# EAGLE design VGA_Tetris (EAGLE 5.11)
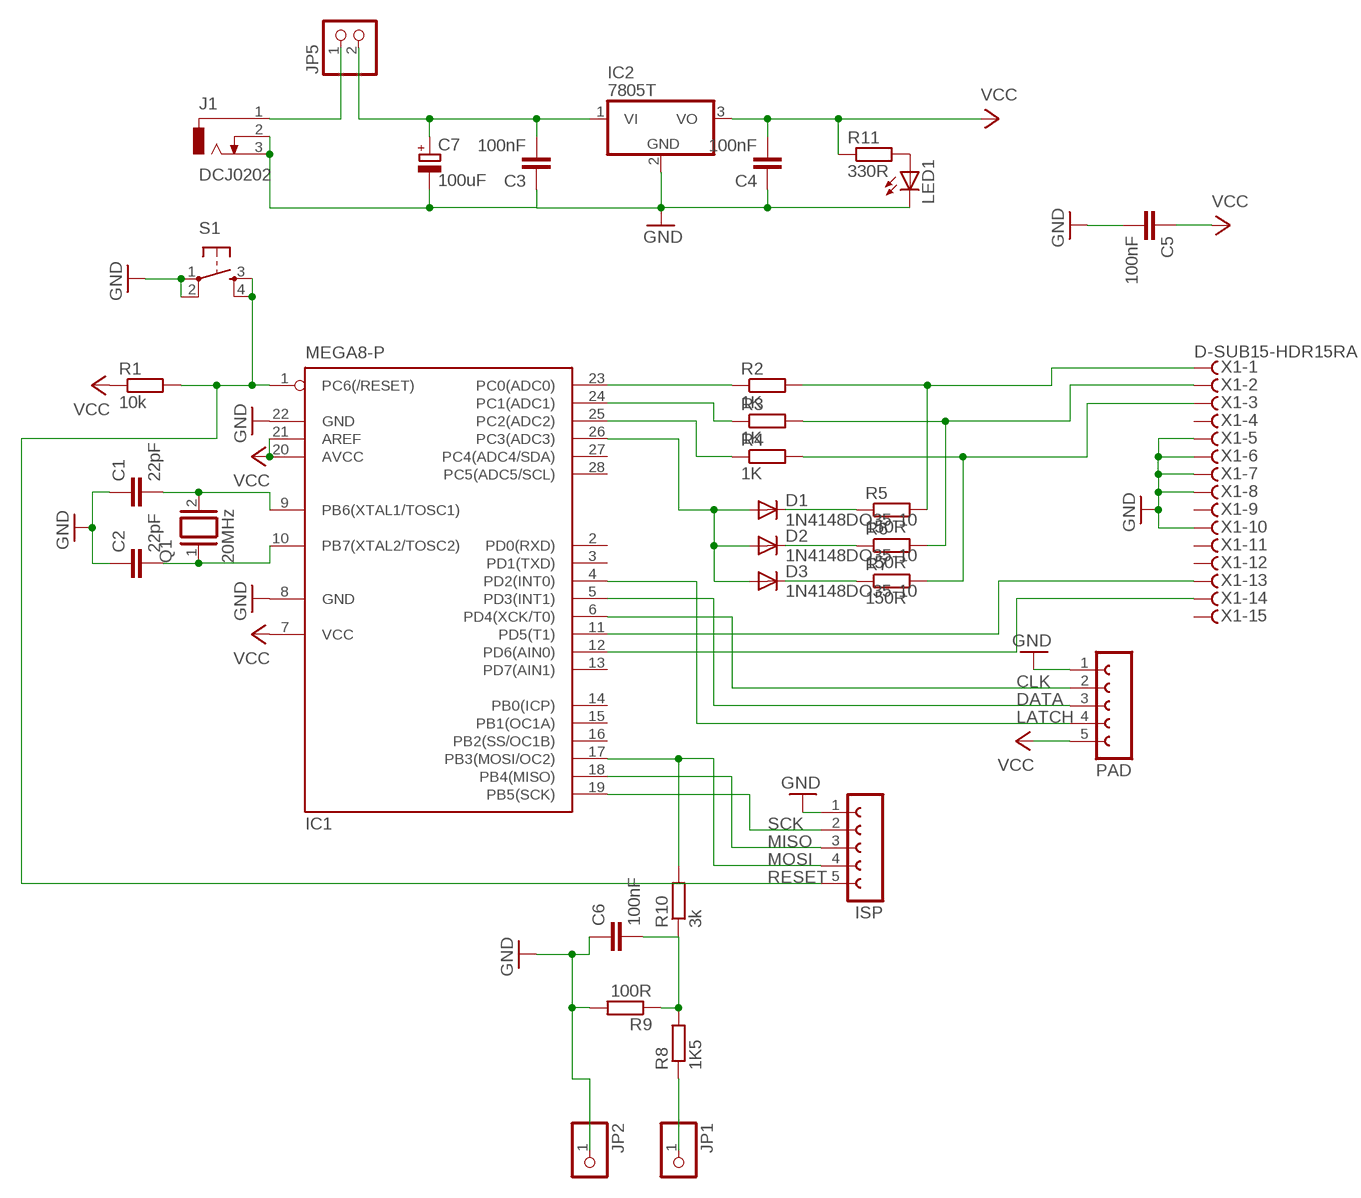
[diagram p0: schematic, sheet 1]

## Parts
C1  22pF  C-EU025-024X044  [C025-024X044]
C2  22pF  C-EU025-024X044  [C025-024X044]
C3  100nF  C-EU025-024X044  [C025-024X044]
C4  100nF  C-EU025-024X044  [C025-024X044]
C5  100nF  C-EU025-024X044  [C025-024X044]
C6  100nF  C-EU025-024X044  [C025-024X044]
C7  100uF  CPOL-EUE5-10.5  [E5-10,5]
D1  1N4148DO35-10  [DO35-10]
D2  1N4148DO35-10  [DO35-10]
D3  1N4148DO35-10  [DO35-10]
IC1  MEGA8-P  [DIL28-3]
IC2  7805T  [TO220H]
ISP  FE05-1  [FE05-1]
J1  DCJ0202  [DCJ0202]
JP1  PINHD-1X1  [1X01]
JP2  PINHD-1X1  [1X01]
JP5  PINHD-1X2  [1X02]
LED1  LED3MM  [LED3MM]
PAD  FE05-1  [FE05-1]
Q1  20MHz  XTAL/S  [QS]
R1  10k  R-EU_0207/10  [0207/10]
R2  1K  R-EU_0207/10  [0207/10]
R3  1K  R-EU_0207/10  [0207/10]
R4  1K  R-EU_0207/10  [0207/10]
R5  150R  R-EU_0207/10  [0207/10]
R6  150R  R-EU_0207/10  [0207/10]
R7  150R  R-EU_0207/10  [0207/10]
R8  1K5  R-EU_0207/10  [0207/10]
R9  100R  R-EU_0207/10  [0207/10]
R10  3k  R-EU_0207/10  [0207/10]
R11  330R  R-EU_0207/10  [0207/10]
S1  TAC_SWITCHPTH  [TACTILE-PTH]
X1  D-SUB15-HDR15RA  [HDR15RA]

## Nets
CLK: IC1.6(PD4(XCK/T0)) PAD.2
DATA: IC1.5(PD3(INT1)) PAD.3
GND: C1.1 C2.1 C3.1 C4.1 C5.2 C6.1 C7.- IC1.8(GND) IC1.22(GND) IC2.2(GND) ISP.1 J1.2 J1.3 JP2.1 LED1.K(C) PAD.1 R9.2 S1.1 S1.2 X1.5 X1.6 X1.7 X1.8 X1.10
LATCH: IC1.4(PD2(INT0)) PAD.4
MISO: IC1.18(PB4(MISO)) ISP.3
MOSI: IC1.17(PB3(MOSI/OC2)) ISP.4 R10.2
N$1: C1.2 IC1.9(PB6(XTAL1/TOSC1)) Q1.2
N$2: C2.2 IC1.10(PB7(XTAL2/TOSC2)) Q1.1
N$3: C3.2 C7.+ IC2.1(VI) JP5.2
N$5: IC1.23(PC0(ADC0)) R2.1
N$6: IC1.24(PC1(ADC1)) R3.1
N$7: IC1.25(PC2(ADC2)) R4.1
N$8: D1.A D2.A D3.A IC1.26(PC3(ADC3))
N$9: D1.C R5.1
N$10: D2.C R6.1
N$11: D3.C R7.1
N$12: R2.2 R5.2 X1.1
N$13: R3.2 R6.2 X1.2
N$14: R4.2 R7.2 X1.3
N$15: JP1.1 R8.1
N$16: LED1.A R11.2
N$18: IC1.11(PD5(T1)) X1.13
N$19: IC1.12(PD6(AIN0)) X1.14
N$23: C6.2 R8.2 R9.1 R10.1
N$26: J1.1 JP5.1
RESET: IC1.1(PC6(/RESET)) ISP.5 R1.2 S1.3 S1.4
SCK: IC1.19(PB5(SCK)) ISP.2
VCC: C4.2 C5.1 IC1.7(VCC) IC1.20(AVCC) IC1.21(AREF) IC2.3(VO) PAD.5 R1.1 R11.1
Unconnected: IC1.2(PD0(RXD)) IC1.3(PD1(TXD)) IC1.13(PD7(AIN1)) IC1.14(PB0(ICP)) IC1.15(PB1(OC1A)) IC1.16(PB2(SS/OC1B)) IC1.27(PC4(ADC4/SDA)) IC1.28(PC5(ADC5/SCL)) X1.4 X1.9 X1.11 X1.12 X1.15

## Library data of the parts
C1-C6 = resistor:C-EU: CAPACITOR, European symbol
C7 = rcl:CPOL-EU: POLARIZED CAPACITOR, European symbol
D1-D3 = diode:1N4148: DIODE high speed (Philips)
IC1 = atmel:MEGA8-P: MICROCONTROLLER 8 Kbytes FLASH, 1 kbytes SRAM, 512 bytes EEPROM, USART, 4-channel 10 bit ADC, 2-channel 8 bit ADC Pin compatible with Atmega48, ATMega88, ATMega168 Source: avr.lbr; OC_FARNELL: unknown; OC_NEWARK: unknown
IC2 = linear:78*: Positive VOLTAGE REGULATOR Source: http://cache.national.com/ds/LM/LM78L05.pdf http://www.fairchildsemi.com/ds/LM/LM7805.pdf
ISP PAD = con-lsta:FE05-1: FEMALE HEADER; OC_FARNELL: unknown; OC_NEWARK: unknown
J1 = con-jack:DCJ0202: DC POWER JACK Source: DCJ0202.pdf; OC_FARNELL: unknown; OC_NEWARK: unknown
JP1 JP2 = pinhead:PINHD-1X1: PIN HEADER
JP5 = pinhead:PINHD-1X2: PIN HEADER
LED1 = SparkFun:LED: LEDs Standard schematic elements and footprints for 5mm, 3mm, 1206, and 0603 sized LEDs. 5mm - Spark Fun Electronics SKU : COM-00529 (and others)
Q1 = special:XTAL/S: CRYSTAL
R1-R11 = rcl:R-EU_: RESISTOR, European symbol
S1 = SparkFun:TAC_SWITCH: Momentary Switch Button commonly used for reset or general input. Spark Fun Electronics SKU : COM-00097
X1 = con-thomas-betts:D-SUB15-: D-Subminiatur Connector Source: Electronioc Interconnects European Edition 1998; OC_FARNELL: unknown; OC_NEWARK: unknown

## Board
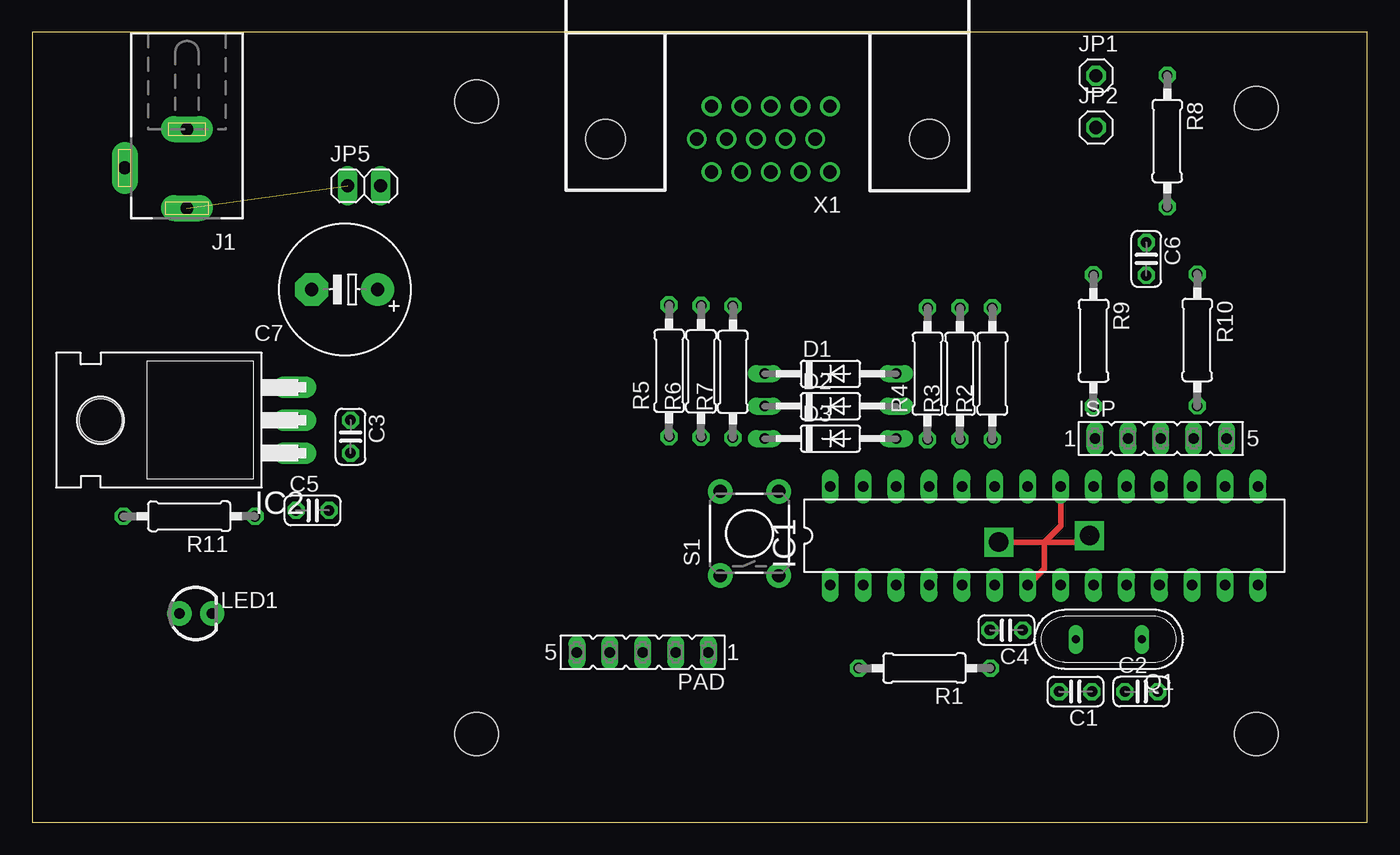
[diagram p1: board, top side]
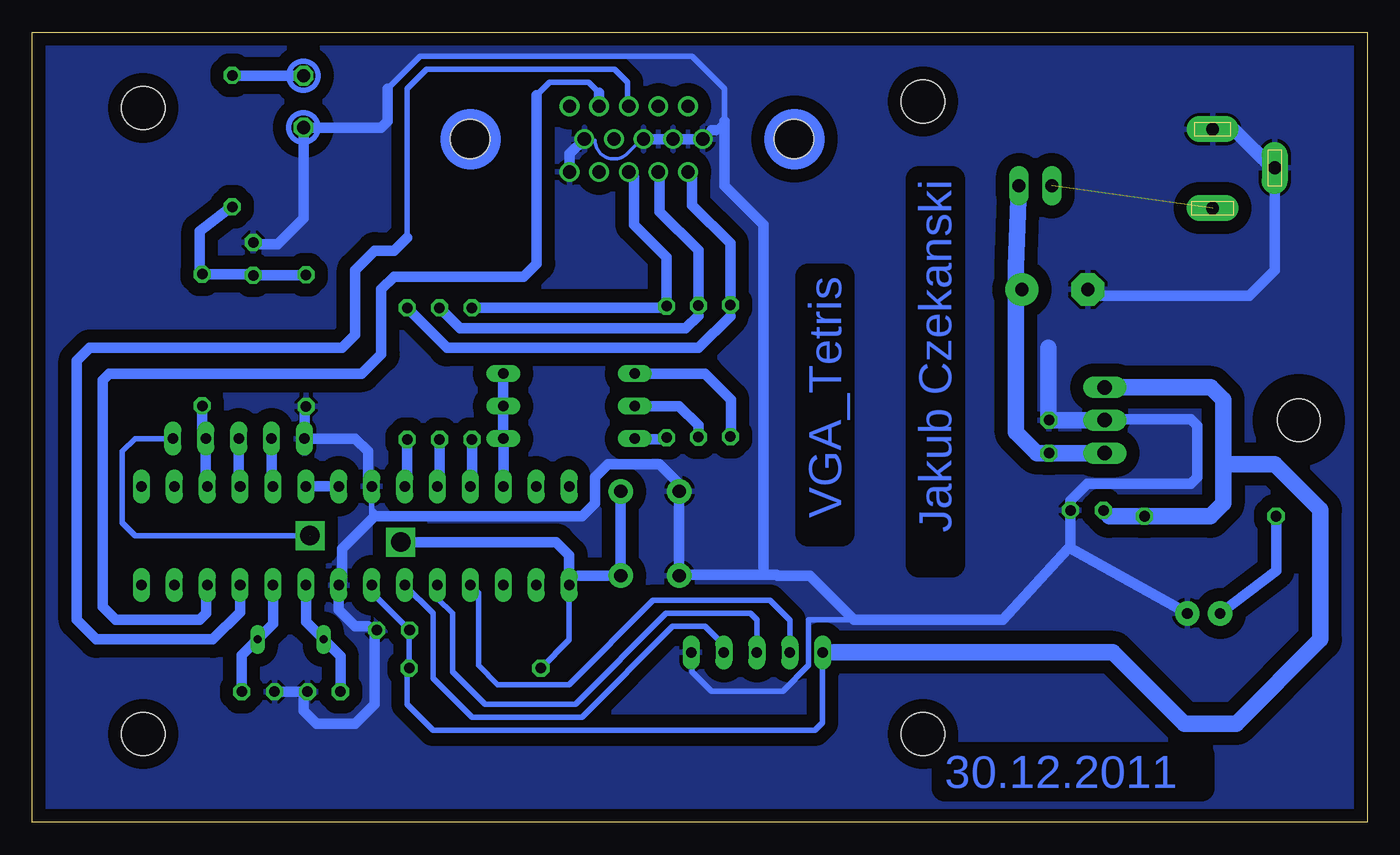
[diagram p2: board, bottom side, seen from below]

Size 103.04 x 60.95 mm. Coordinates in mm from the lower left corner, seen from the top.
Outline: 0,0 103.04,0 103.04,60.95 0,60.95 0,0
Copper layers (1*16): Top 0.035mm / dielectric 1.5mm / Bottom 0.035mm
Design rules "default": minimum track width 10mil, minimum drill 24mil, track to track 8mil, track to pad 8mil, pad to pad 8mil, via to via 8mil, smd to smd 8mil, copper to edge 40mil, drill to drill 8mil, minimum pad ring 10mil, minimum via ring 8mil, stop-mask expansion 4mil, vias tented up to drill 0mil, thermal gap 10mil
Holes 3.35 mm at 34.29,6.81 94.48,6.81 34.29,55.61 94.48,55.11

### Footprints (pad centres in the part's own frame; a part is rotated, then mirrored left to right if it is on the bottom)
C025-024X044 = drill 0.813 octagon: 1 -1.27,0; 2 1.27,0
E5-10,5 = drill 1.016 pad 2.54 round: + -2.54,0 | drill 1.016 pad 2.54 octagon: - 2.54,0
DO35-10 = drill 0.813 long: A 5.08,0; C -5.08,0
DIL28-3 = drill 0.813 long: 1 -16.51,-3.81; 2 -13.97,-3.81; 3 -11.43,-3.81; 4 -8.89,-3.81; 5 -6.35,-3.81; 6 -3.81,-3.81; 7 -1.27,-3.81; 8 1.27,-3.81; 9 3.81,-3.81; 10 6.35,-3.81; 11 8.89,-3.81; 12 11.43,-3.81; 13 13.97,-3.81; 14 16.51,-3.81; 15 16.51,3.81; 16 13.97,3.81; 17 11.43,3.81; 18 8.89,3.81; 19 6.35,3.81; 20 3.81,3.81; 21 1.27,3.81; 22 -1.27,3.81; 23 -3.81,3.81; 24 -6.35,3.81; 25 -8.89,3.81; 26 -11.43,3.81; 27 -13.97,3.81; 28 -16.51,3.81
TO220H = drill 1.118 long: 1 -2.54,-10.16; 2 0,-10.16; 3 2.54,-10.16 | hole 3.302: 0,4.826
FE05-1 = drill 0.813 long: 1 -5.08,0; 2 -2.54,0; 3 0,0; 4 2.54,0; 5 5.08,0
DCJ0202 = drill 1 pad 2 long: 1 0,3.1; 2 4.8,0; 3 0,-3
1X01 = drill 1.016 octagon: 1 0,0
1X02 = drill 1.016 long: 1 -1.27,0; 2 1.27,0
LED3MM = drill 0.813 pad 1.88 round: A -1.27,0; K 1.27,0
QS = drill 0.61 long: 1 -2.54,0; 2 2.54,0
0207/10 = drill 0.813 octagon: 1 -5.08,0; 2 5.08,0
TACTILE-PTH = drill 1.016 pad 1.88 round: 1 -3.251,2.261; 2 3.251,2.261; 3 -3.251,-2.261; 4 3.251,-2.261
HDR15RA = drill 1.016 round: 1 4.318,2.54; 2 2.032,2.54; 3 -0.254,2.54; 4 -2.54,2.54; 5 -4.826,2.54; 6 5.461,0; 7 3.175,0; 8 0.889,0; 9 -1.397,0; 10 -3.683,0; 11 4.318,-2.54; 12 2.032,-2.54; 13 -0.254,-2.54; 14 -2.54,-2.54; 15 -4.826,-2.54 | hole 3.048: -12.497,0; 12.497,0

### Placement (x,y rotation side)
C1  80.53,10.08 180 top
C2  85.61,10.08 0 top
C3  24.56,29.75 270 top
C4  75.19,14.82 180 top
C5  21.63,24.06 0 top
C6  85.99,43.47 270 top
C7  24.11,41.11 180 top
D1  61.61,34.61 0 top
D2  61.61,32.11 0 top
D3  61.61,29.61 0 top
IC1  78.11,22.11 0 top
IC2  10.09,31.02 90 top
ISP  87.11,29.61 0 top
J1  11.93,50.49 180 top
JP1  82.11,57.61 0 top
JP2  82.11,53.61 0 top
JP5  25.61,49.11 0 top
LED1  12.61,16.11 0 top
PAD  47.11,13.11 180 top
Q1  83.11,14.11 180 top
R1  68.87,11.89 180 top
R2  74.11,34.61 90 top
R3  71.61,34.61 90 top
R4  69.11,34.61 90 top
R5  49.16,34.83 90 top
R6  51.62,34.79 90 top
R7  54.08,34.75 90 top
R8  87.61,52.56 270 top
R9  81.92,37.16 270 top
R10  89.92,37.21 270 top
R11  12.11,23.61 180 top
S1  55.36,22.28 90 top
X1  56.75,52.72 180 top

### Tracks (layer width: path | path; a pad name or v marks a point on that pad's centre or on a via)
CLK
  Bottom 0.406: PAD.2 49.65,13.65 51.11,15.11 53.61,15.11 60.61,8.11 69.11,8.11 72.11,11.11 72.11,16.11 IC1.6
DATA
  Bottom 0.406: IC1.5 71.76,17.26 70.61,16.11 70.61,11.61 68.11,9.11 61.11,9.11 54.11,16.11 47.61,16.11 47.11,15.61 PAD.3
GND
  Bottom 0.254: X1.8 56,52.72 57.11,51.61 arc134 59.61,52.61 60.43,52.61 X1.10
  Bottom 0.406: 76.84,24.11 76.84,23.38 | 76.84,24.11 IC1.22 77.11,26.19 | 79.11,18.57 IC1.8 | C3.1 24.61,31.07 24.61,31.11 20.16,31.11 IC2.2 | C4.1 76.75,15.11 77.11,15.11 76.61,14.61 | S1.2 S1.1 45.53,19.03 45.61,19.11 | C5.2 22.9,24.82 23.11,24.61 23.11,21.11 | 82.03,31.97 R9.2 | C6.1 85.86,44.61 86.11,44.61 | PAD.1 52.11,13.03 52.11,11.61 50.61,10.11 45.11,10.11 43.11,12.11 43.11,15.61 39.61,15.61 | 28.11,15.61 27.42,16.61 22.9,21.13 | 82.11,9.77 C1.1 | 76.34,23.61 76.84,24.11 | 50.61,53.4 X1.6 | 50.32,53.4 49.61,54.11 49.61,56.61 52.11,59.11 73.11,59.11 75.61,56.61 | 47.11,19.11 46.61,19.61
  Bottom 0.813: C1.1 C2.1 | 76.84,23.38 79.11,21.11 79.11,18.57 | IC1.8 79.38,16.38 78.11,15.11 77.11,15.11 | 77.11,26.19 77.11,28.61 78.11,29.61 ISP.1 82.03,31.97 | C5.2 22.9,21.13 LED1.K | 22.9,24.82 21.61,26.11 13.61,26.11 13.11,26.61 13.11,30.61 13.61,31.11 20.16,31.11 | 85.86,44.61 84.11,44.61 82.11,46.61 JP2.1 76.11,53.61 75.61,54.11 75.61,56.61 | 76.61,14.61 76.61,9.11 78.11,7.61 81.11,7.61 82.11,8.61 82.11,9.77 | 23.11,21.11 28.11,15.61 39.61,15.61 43.03,19.03 45.53,19.03 | 45.61,19.11 47.11,19.11 53.11,19.11 53.11,26.11 54.61,27.61 58.61,27.61 59.61,26.61 59.61,24.61 60.61,23.61 76.34,23.61 | X1.6 X1.7 X1.8 | X1.10 61.58,51.58 X1.5 | 50.32,53.4 50.61,53.4 | 49.61,54.11 49.61,49.11 46.61,46.11 46.61,19.61 | J1.2 10.13,53.49 J1.3 10.49,53.49 7.11,50.11 7.11,42.61 9.11,40.61 21.07,40.61 C7.-
  Bottom 1.27: IC2.2 C3.1 | 24.61,31.11 24.61,36.61
  pour Bottom (isolate 1.016): -7.27,61.73 -5.77,-3.27 105.64,-2.77 106.14,62.23
LATCH
  Bottom 0.406: PAD.4 44.57,15.57 46.11,17.11 55.11,17.11 61.61,10.61 67.11,10.61 68.61,12.11 68.61,17.69 IC1.4
MISO
  Bottom 0.406: IC1.18 87.11,26.03
  Bottom 0.813: 87.11,26.03 ISP.3
MOSI
  Bottom 0.406: IC1.17 89.65,26.03 | ISP.4 89.92,29.88
  Bottom 0.813: 89.65,26.03 ISP.4 | 89.92,29.88 R10.2
N$1
  Bottom 0.813: IC1.9 81.92,15.46 Q1.2 79.26,12.8 C1.2
N$2
  Bottom 0.813: IC1.10 84.46,15.3 Q1.1 86.88,12.88 C2.2
N$3
  Bottom 0.406: IC2.1 C3.2
  Bottom 1.27: IC2.1 25.48,28.48 27.11,30.11 27.11,41.11 | 27.11,41.11 27.11,42.88 JP5.2 | 27.11,41.11 C7.+
N$5
  Bottom 0.406: 74.11,26.11 IC1.23
  Bottom 0.813: 74.11,26.11 R2.1
N$6
  Bottom 0.406: 71.61,26.07 IC1.24
  Bottom 0.813: 71.61,26.07 R3.1
N$7
  Bottom 0.406: 69.11,26.03 IC1.25
  Bottom 0.813: 69.11,26.03 R4.1
N$8
  Bottom 0.406: 66.68,29.41 D3.A
  Bottom 0.813: IC1.26 66.68,29.41 | D3.A D2.A D1.A
N$9
  Bottom 0.406: R5.1 49.11,29.8
  Bottom 0.813: D1.C 51.11,34.61 49.11,32.61 49.11,29.8
N$10
  Bottom 0.813: R6.1 51.62,30.62 53.11,32.11 D2.C
N$11
  Bottom 0.813: D3.C 55.96,29.55 54.2,29.55 R7.1
N$12
  Bottom 0.406: R5.2 49.16,39.06
  Bottom 0.813: 49.16,39.06 51.61,36.61 71.03,36.61 R2.2 | R5.2 49.16,44.66 52.11,47.61 52.11,49.86 X1.1
N$13
  Bottom 0.406: 51.62,39.1 R6.2
  Bottom 0.813: 51.62,39.1 52.61,38.11 70.03,38.11 R3.2 | R6.2 51.62,44.12 54.61,47.11 54.61,50.07 X1.2
N$14
  Bottom 0.406: R7.2 54.22,39.69
  Bottom 0.813: 54.22,39.69 R4.2 | R7.2 54.08,43.58 56.61,46.11 56.61,49.79 X1.3
N$15
  Bottom 0.813: JP1.1 87.58,57.61 R8.1
N$16
  Bottom 0.813: R11.2 7.03,19.42 LED1.A
N$18
  Bottom 0.406: 74.11,45.11 74.11,56.61 72.61,58.11 58.11,58.11 57.11,57.11 57.11,55.37 X1.13
  Bottom 0.813: IC1.11 87,16.22 89.11,14.11 98.11,14.11 99.61,15.61 99.61,35.61 98.61,36.61 79.11,36.61 78.11,37.61 78.11,42.61 76.61,44.11 75.11,44.11 74.11,45.11
N$19
  Bottom 0.406: 59.29,56.29 60.11,57.11 63.11,57.11 64.11,56.11 | 89.61,18.23 IC1.12
  Bottom 0.813: 59.29,56.29 X1.14 | 64.11,56.11 64.11,43.11 65.11,42.11 75.11,42.11 76.11,41.11 76.11,36.11 77.61,34.61 97.11,34.61 97.61,34.11 97.61,16.61 96.61,15.61 90.11,15.61 89.61,16.11 89.61,18.23
N$23
  Bottom 0.406: 87.92,47.29 R8.2 | C6.2 86.08,42.29 | R9.1 81.96,42.2
  Bottom 0.813: 87.92,47.29 90.11,45.61 90.11,42.29 R10.1 86.08,42.29 | 81.96,42.2 C6.2
N$26  (1 unrouted)
N$27  (via drill 1.5)
  other vias: 81.61,22.11
RESET  (via drill 1.5)  (1 unrouted)
  Top 0.406: v74.61,21.61 81.11,21.61 81.61,22.11
  Bottom 0.406: R1.2 61.6,14.08 IC1.1 60.87,19.03 | ISP.5 95.11,29.61 96.11,28.61 96.11,23.11 95.11,22.11 81.61,22.11
  Bottom 0.813: S1.4 S1.3 60.87,19.03 | IC1.1 61.6,20.6 62.61,21.61 v74.61,21.61
SCK
  Bottom 0.406: IC1.19 84.57,26.03
  Bottom 0.813: 84.57,26.03 ISP.2
VCC
  Top 0.406: IC1.21 79.38,22.88 78.11,21.61 78.11,19.57 IC1.7
  Bottom 0.406: IC1.7 76.84,17.74 C4.2 73.95,14.79 R1.1 74.11,11.73 74.11,9.11 72.11,7.11 42.61,7.11 42.03,7.69 PAD.5 | 10.61,27.61 11.11,27.11
  Bottom 0.813: IC1.21 IC1.20
  Bottom 1.27: IC2.3 12.06,33.56 11.11,32.61 11.11,27.11 11.11,24.61 12.11,23.61 R11.1 19.91,23.61 C5.1 | PAD.5 19.61,13.11 14.11,7.61 10.11,7.61 3.61,14.11 3.61,24.11 7.11,27.61 10.61,27.61
(copper drawn outside any net)
  shapes: Bottom circle x4

### Text on the board
Bottom: Jakub Czekanski | VGA_Tetris | 30.12.2011